# EAGLE design Sensor-platiene (EAGLE 9.6.1)
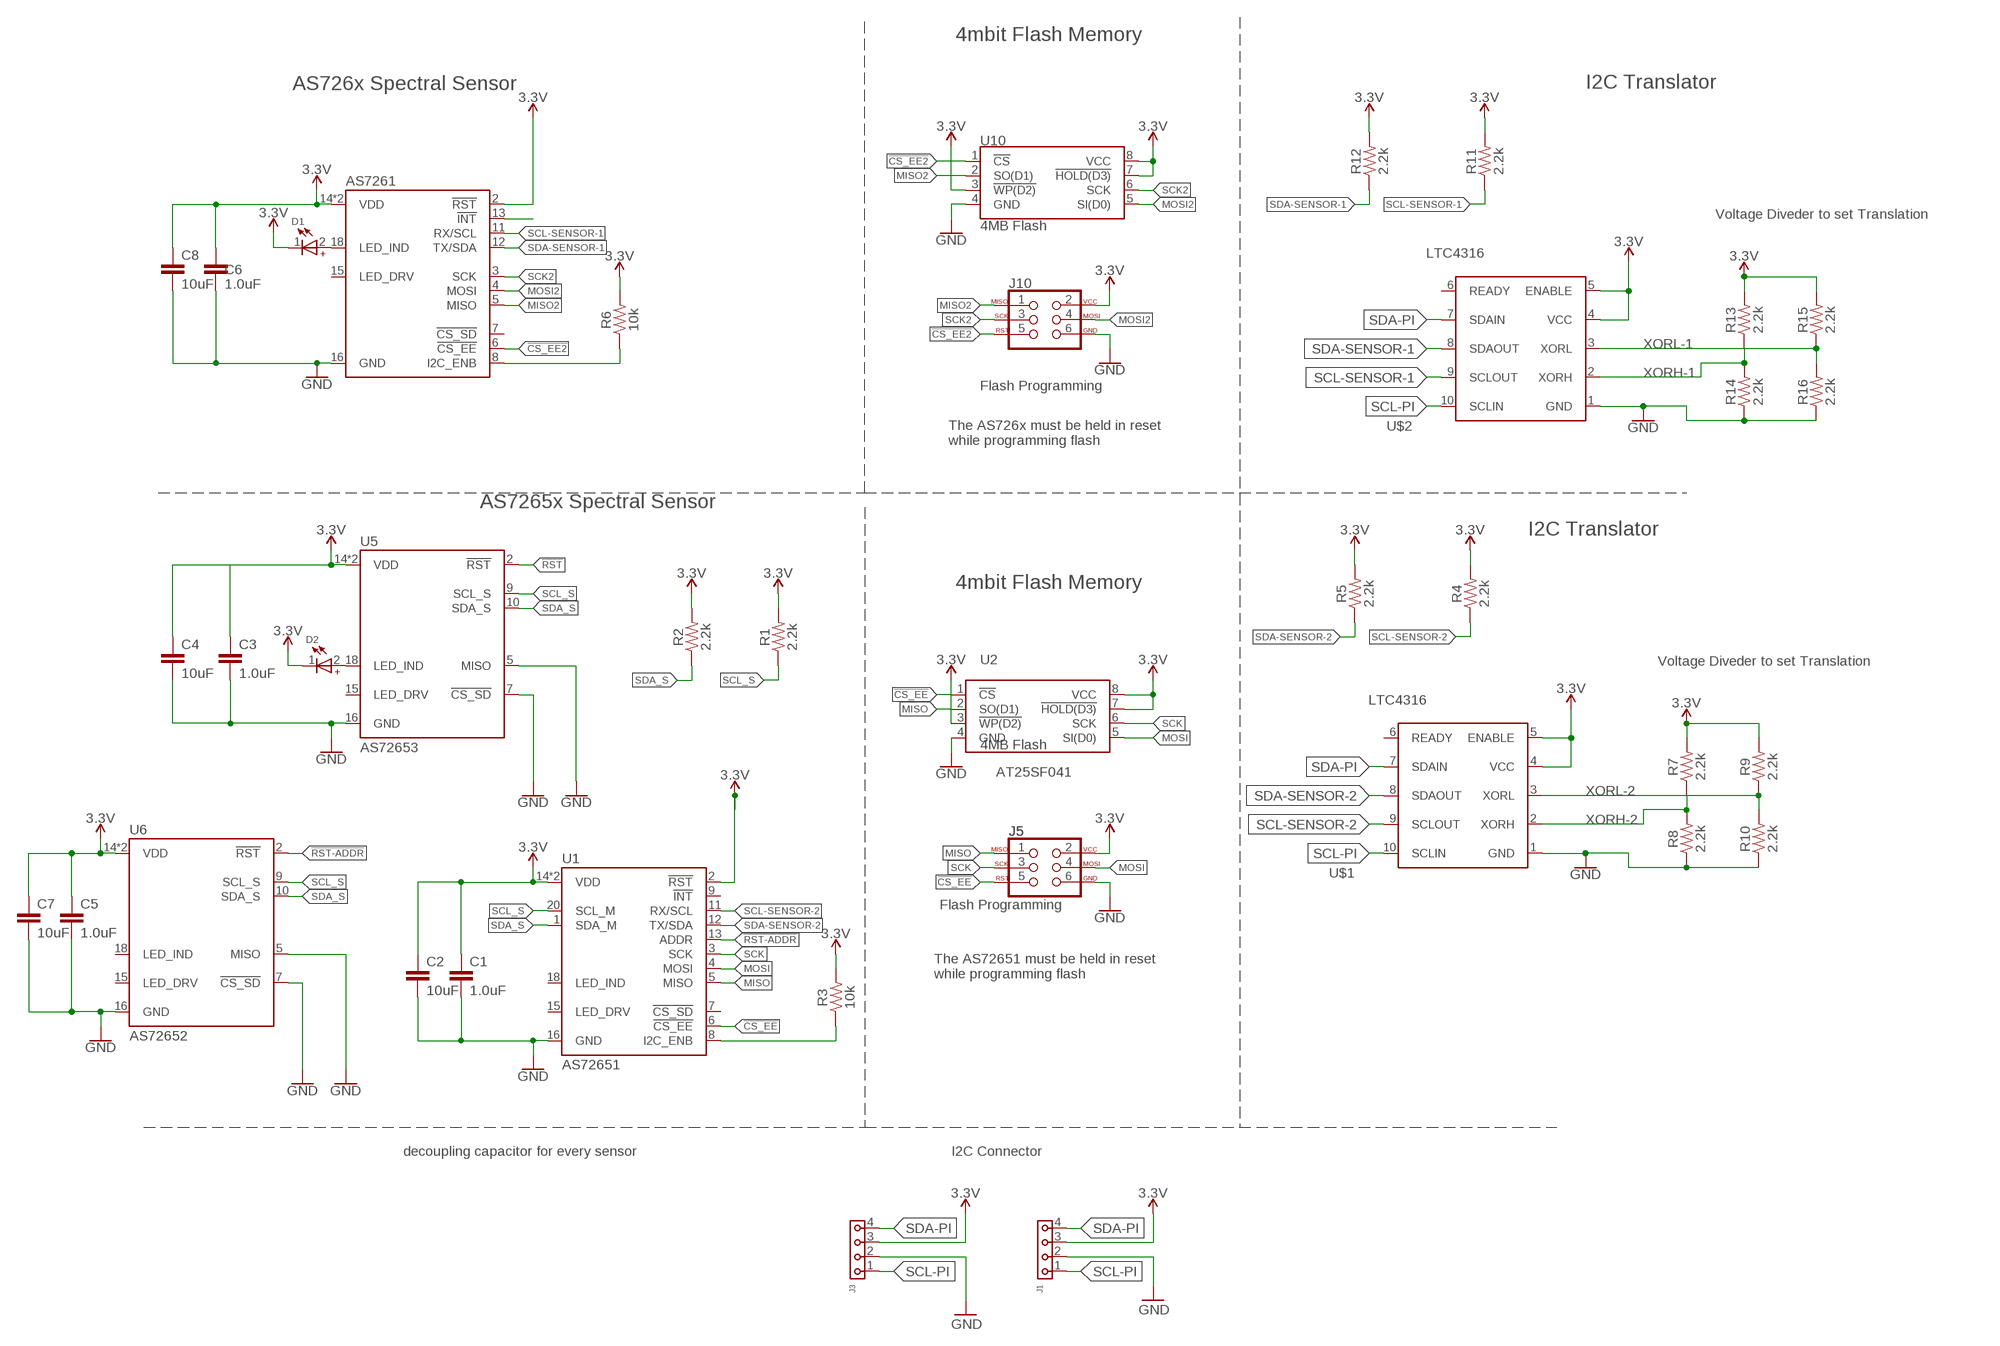
[diagram p0: schematic, sheet 1]

## Parts
AS7261  IR  AS726XIR  [LGA20]
C1  1.0uF  1.0UF-0603-16V-10%  [0603]
C2  10uF  10UF-0603-6.3V-20%  [0603]
C3  1.0uF  1.0UF-0603-16V-10%  [0603]
C4  10uF  10UF-0603-6.3V-20%  [0603]
C5  1.0uF  1.0UF-0603-16V-10%  [0603]
C6  1.0uF  1.0UF-0603-16V-10%  [0603]
C7  10uF  10UF-0603-6.3V-20%  [0603]
C8  10uF  10UF-0603-6.3V-20%  [0603]
D1  WL-SMCW_1206_150120RS75000  [WL-SMCW_1206]
D2  WL-SMCW_1206_150120RS75000  [WL-SMCW_1206]
J1  6130XX11821_61300411821  [61300411821]
J3  6130XX11821_61300411821  [61300411821]
J5  Flash Programming  AVR_SPI_PROG_3X2TESTPOINTS  [2X3_TEST_POINTS]
J10  Flash Programming  AVR_SPI_PROG_3X2TESTPOINTS  [2X3_TEST_POINTS]
R1  2.2k  2.2KOHM-0603-1/10W-1%  [0603]
R2  2.2k  2.2KOHM-0603-1/10W-1%  [0603]
R3  10k  10KOHM-0603-1/10W-1%  [0603]
R4  2.2k  2.2KOHM-0603-1/10W-1%  [0603]
R5  2.2k  2.2KOHM-0603-1/10W-1%  [0603]
R6  10k  10KOHM-0603-1/10W-1%  [0603]
R7  2.2k  2.2KOHM-0603-1/10W-1%  [0603]
R8  2.2k  2.2KOHM-0603-1/10W-1%  [0603]
R9  2.2k  2.2KOHM-0603-1/10W-1%  [0603]
R10  2.2k  2.2KOHM-0603-1/10W-1%  [0603]
R11  2.2k  2.2KOHM-0603-1/10W-1%  [0603]
R12  2.2k  2.2KOHM-0603-1/10W-1%  [0603]
R13  2.2k  2.2KOHM-0603-1/10W-1%  [0603]
R14  2.2k  2.2KOHM-0603-1/10W-1%  [0603]
R15  2.2k  2.2KOHM-0603-1/10W-1%  [0603]
R16  2.2k  2.2KOHM-0603-1/10W-1%  [0603]
U1  AS72651  [LGA20]
U2  4MB Flash  AT25SF041  [SO08]
U5  AS72653  [LGA20]
U6  AS72652  [LGA20]
U10  4MB Flash  AT25SF041  [SO08]
U$1  LTC4316  [MS-PACKAGE]
U$2  LTC4316  [MS-PACKAGE]

## Nets
3.3V [Power]: AS7261.2(!RST) AS7261.14(VDD) AS7261.17(VDD) C1.1 C2.1 C3.1 C4.1 C5.1 C6.1 C7.1 C8.1 D1.1(-) D2.1(-) J1.3 J3.3 J5.2 J10.2 R1.2 R2.2 R3.2 R4.2 R5.2 R6.2 R7.2 R9.2 R11.2 R12.2 R13.2 R15.2 U1.2(!RST) U1.14(VDD) U1.17(VDD) U2.3(!WP(D2)) U2.7(!HOLD(D3)) U2.8(VCC) U5.14(VDD) U5.17(VDD) U6.14(VDD) U6.17(VDD) U10.3(!WP(D2)) U10.7(!HOLD(D3)) U10.8(VCC) U$1.4(VCC) U$1.5(ENABLE) U$2.4(VCC) U$2.5(ENABLE)
!CS_EE: J5.5 U1.6(!CS_EE) U2.1(!CS)
!CS_EE2: AS7261.6(!CS_EE) J10.5 U10.1(!CS)
!RST: U5.2(!RST)
!RST-ADDR: U1.13(ADDR) U6.2(!RST)
GND: AS7261.16(GND) C1.2 C2.2 C3.2 C4.2 C5.2 C6.2 C7.2 C8.2 J1.2 J3.2 J5.6 J10.6 R8.1 R10.1 R14.1 R16.1 U1.16(GND) U2.4(GND) U5.5(MISO) U5.7(!CS_SD) U5.16(GND) U6.5(MISO) U6.7(!CS_SD) U6.16(GND) U10.4(GND) U$1.1(GND) U$2.1(GND)
I2C_ENB: R3.1 U1.8(I2C_ENB)
MISO: J5.1 U1.5(MISO) U2.2(SO(D1))
MISO2: AS7261.5(MISO) J10.1 U10.2(SO(D1))
MOSI: J5.4 U1.4(MOSI) U2.5(SI(D0))
MOSI2: AS7261.4(MOSI) J10.4 U10.5(SI(D0))
N$1: AS7261.18(LED_IND) D1.2(+)
N$3: AS7261.8(I2C_ENB) R6.1
N$4: D2.2(+) U5.18(LED_IND)
N$6: AS7261.13(!INT)
SCK: J5.3 U1.3(SCK) U2.6(SCK)
SCK2: AS7261.3(SCK) J10.3 U10.6(SCK)
SCL-PI: J1.1 J3.1 U$1.10(SCLIN) U$2.10(SCLIN)
SCL-SENSOR-1: AS7261.11(RX/SCL) R11.1 U$2.9(SCLOUT)
SCL-SENSOR-2: R4.1 U1.11(RX/SCL) U$1.9(SCLOUT)
SCL_S: R1.1 U1.20(SCL_M) U5.9(SCL_S) U6.9(SCL_S)
SDA-PI: J1.4 J3.4 U$1.7(SDAIN) U$2.7(SDAIN)
SDA-SENSOR-1: AS7261.12(TX/SDA) R12.1 U$2.8(SDAOUT)
SDA-SENSOR-2: R5.1 U1.12(TX/SDA) U$1.8(SDAOUT)
SDA_S: R2.1 U1.1(SDA_M) U5.10(SDA_S) U6.10(SDA_S)
XORH-1 [Power]: R13.1 R14.2 U$2.2(XORH)
XORH-2 [Power]: R7.1 R8.2 U$1.2(XORH)
XORL-1 [Power]: R15.1 R16.2 U$2.3(XORL)
XORL-2 [Power]: R9.1 R10.2 U$1.3(XORL)
Unconnected: AS7261.7(!CS_SD) AS7261.15(LED_DRV) U1.7(!CS_SD) U1.9(!INT) U1.15(LED_DRV) U1.18(LED_IND) U5.15(LED_DRV) U6.15(LED_DRV) U6.18(LED_IND) U$1.6(READY) U$2.6(READY)

## Notes on the sheet
- 4mbit Flash Memory
- AS726x Spectral Sensor | I2C Translator
- Voltage Diveder to set Translation
- The AS726x must be held in reset 
  while programming flash
- AS7265x Spectral Sensor
- I2C Translator
- 4mbit Flash Memory
- Voltage Diveder to set Translation
- AT25SF041
- The AS72651 must be held in reset
  while programming flash
- decoupling capacitor for every sensor | I2C Connector

## Library data of the parts
AS7261 = SparkFun-Sensors:AS726X; PROD_ID: IC-13731
C1 C3 C5 C6 = SparkFun-Capacitors:1.0UF: 1µF ceramic capacitors A capacitor is a passive two-terminal electrical component used to store electrical energy temporarily in an electric field.; PROD_ID: CAP-00868
C2 C4 C7 C8 = SparkFun-Capacitors:10UF: 10.0µF ceramic capacitors A capacitor is a passive two-terminal electrical component used to store electrical energy temporarily in an electric field.; PROD_ID: CAP-11015
D1 D2 = 150120RS75000_Eagle_WL-SMCW_rev20b:WL-SMCW_1206: WL-SMCW SMT Mono-color Chip LED Waterclea Characteristics Low energy consumption High reliability Low current requirement Fast switching No UV/IR radiation Smallest SMD LED package for exceptional brightness Top view LED Wide viewing angle Better solder ability Heat dissipation Applications Backlight for mobile and portable device keypads Indoor and outdoor message boards Flat backlight for LCDs, switches and symbols Display for industrial control systems and traffic Miniaturized color effects Pedestrian mark Optical indicators Tabular backlight: LCD, telephone key-press, power-switch, display board Indoor displays Signals Identifiers Backlight for automobile DVD LED General lighting Toys <https://www.we-online.com/catalog/media/o14904v209%20Family_WL-SMCW.jpg> Details see: https://www.we-online.com/catalog/en/WL-SMCW/ Updated BY Yingchun,Shan 2020-03-18 2020(C) Wurth Elektronik; ABSTRAHLWINKEL: 140°; CHIP-TECHNOLOGY: AlInGaP; DATASHEET-URL: https://www.we-online.com/catalog/datasheet/150120RS75000.pdf; EMITTING-COLOR: Red; I-V-TYP: 150mcd; LAMDA-DOM-TYP: 625nm; LAMDA-PEAK-TYP: 630nm; PART-NUMBER: 150120RS75000; V-F-TYP: 2V
J1 J3 = 61300411121_Eagle_WR-PHD_rev19a:6130XX11821_61300411821: WR-PHD 2.54 mm Socket Header ARTICLE PROPERTIES: Pins:1;​ 2;​ 3;​ 4;​ 5;​ 6;​ 7;​ 8;​ 9;​ 10;​ 12;​ 13;​ 14;​ 15;​ 16;​ 18;​ 20;​ 22;​ 24;​ 25;​ 32;​ 36;​ 40 KIND PROPERTIES: Pitch：2.54 mm Quality Class:3 as per CECC 75 301-802 Rows：Single Gender：Socket Header;​ Female Type：Straight MATERIAL PROPERTIES: Insulator Material :PBT Insulator Flammability Rating:UL94 V-0 Contact Material:Copper Alloy Contact Plating:Gold Contact Type:Stamped GENERAL INFORMATION Operating Temperature:-40 up to +125 °C Compliance:Lead free / RoHS ELECTRICAL PROPERTIES: Rated Current:3 A IR 1:3 A Withstanding Voltage:500 V (AC) Contact Resistance:20 mΩ RISO:1000 MΩ CERTIFICATION UL Approval:E323964 PACKAGING PROPERTIES Packaging:Tray <https://katalog.we-online.com/media/images/v2/o33218v209%20Family_WR-PHD_613xxx11821.jpg> Details see: https://katalog.we-online.com/en/em/PHD_2_54_SOCKET_HEADER_6130XX11821 Updated by Yingchun,Shan 2019-10-21 2019 (C) Würth Elektronik; DATASHEET-URL: https://katalog.we-online.com/em/datasheet/61300411821.pdf; GENDER: Socket Header; IR: 3A; MATES: WR-PHD 2.54mm SMT Pin Header/THT Angled Pin Header/THT Pin Header; PACKAGING: Tray; PART-NUMBER: 61300411821; PINS: 4; ROWS: Single; TYPE: Straight
J5 J10 = SparkFun-Connectors:AVR_SPI_PROG_3X2: AVR ISP 6 Pin This is the reduced ISP connector for AVR programming. Common on Arduino. This footprint will take up less PCB space and can be used with a 10-pin to 6-pin adapter such as SKU: BOB-08508 **Special note about "TEST_POINT" package. The stop mask is on the top side, so if you want your programming test points to be on the bottom of your board, make sure to place this package on the bottom side of the board. This also ensure that the orientation to program from the bottom side will be correct. SparkFun Products: SparkFun ISP Pogo Adapter <https://www.sparkfun.com/products/11591> - NS Tiny AVR Programmer <https://www.sparkfun.com/products/11801> -PTH
R1 R2 R4 R5 R7-R16 = SparkFun-Resistors:2.2KOHM: 2.2kΩ resistor A resistor is a passive two-terminal electrical component that implements electrical resistance as a circuit element. Resistors act to reduce current flow, and, at the same time, act to lower voltage levels within circuits. - Wikipedia; PROD_ID: RES-08272
R3 R6 = SparkFun-Resistors:10KOHM: 10kΩ resistor A resistor is a passive two-terminal electrical component that implements electrical resistance as a circuit element. Resistors act to reduce current flow, and, at the same time, act to lower voltage levels within circuits. - Wikipedia; PROD_ID: RES-00824
U1 = Qwiic_Spectral_Sensor-AS7265x:AS72651; PROD_ID: IC-14127
U2 U10 = SparkFun-IC-Memory:AT25SF041: AT25SF041 4Mb Serial Flash Memory 104MHz, SPI, 8-SOIC Datasheet <http://www.adestotech.com/wp-content/uploads/DS-AT25SF041_044.pdf> SparkFun Products: SparkFun ESP8266 Thing <https://www.sparkfun.com/products/13231> SparkFun ESP8266 Thing - Dev Board <https://www.sparkfun.com/products/13711>; PROD_ID: IC-12455
U5 = Qwiic_Spectral_Sensor-AS7265x:AS72653; PROD_ID: IC-14129
U6 = Qwiic_Spectral_Sensor-AS7265x:AS72652; PROD_ID: IC-14128
U$1 U$2 = I2c-adress-translotor:LTC4316

## Net classes
1 Power: width 0.305 mm

## Board
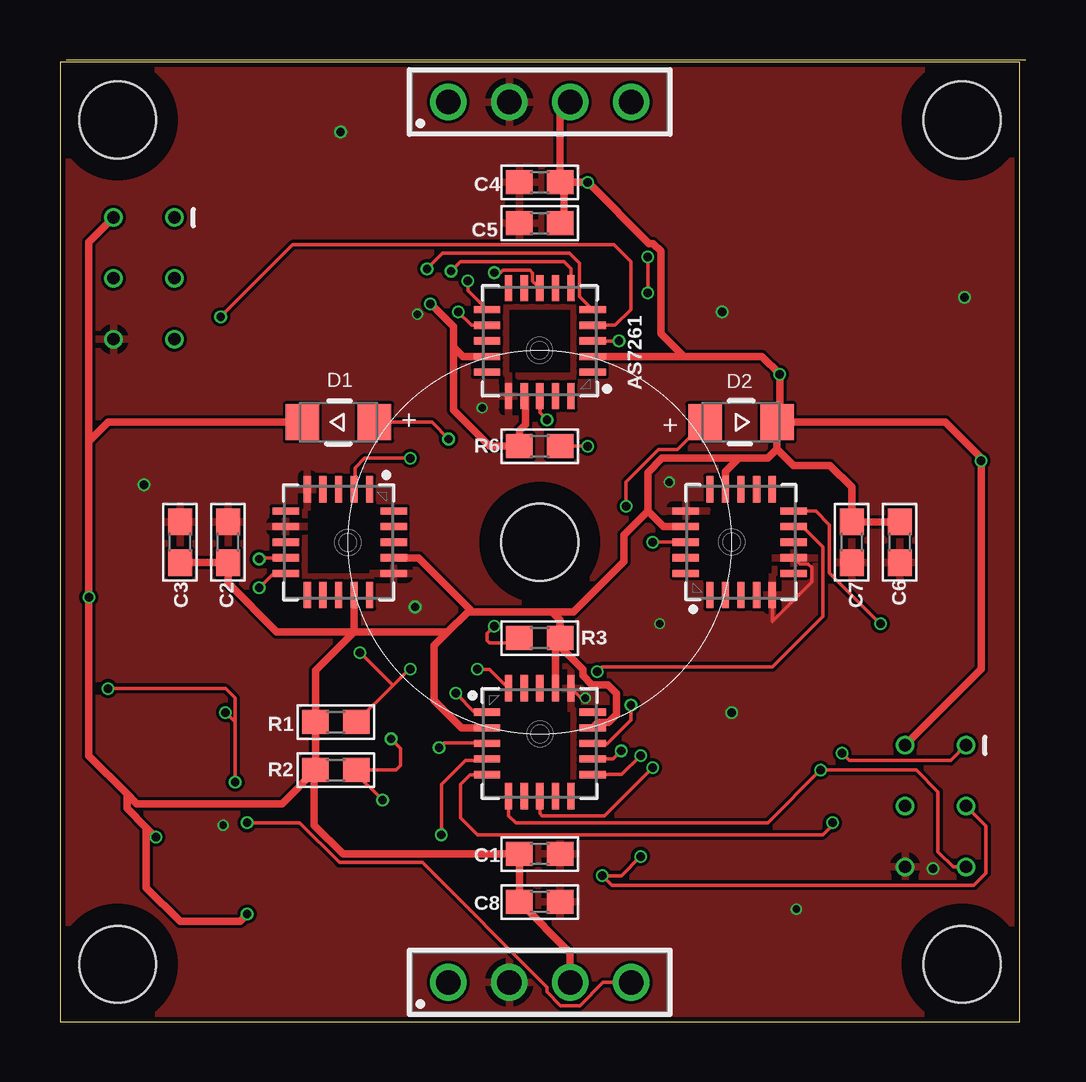
[diagram p1: board, top side]
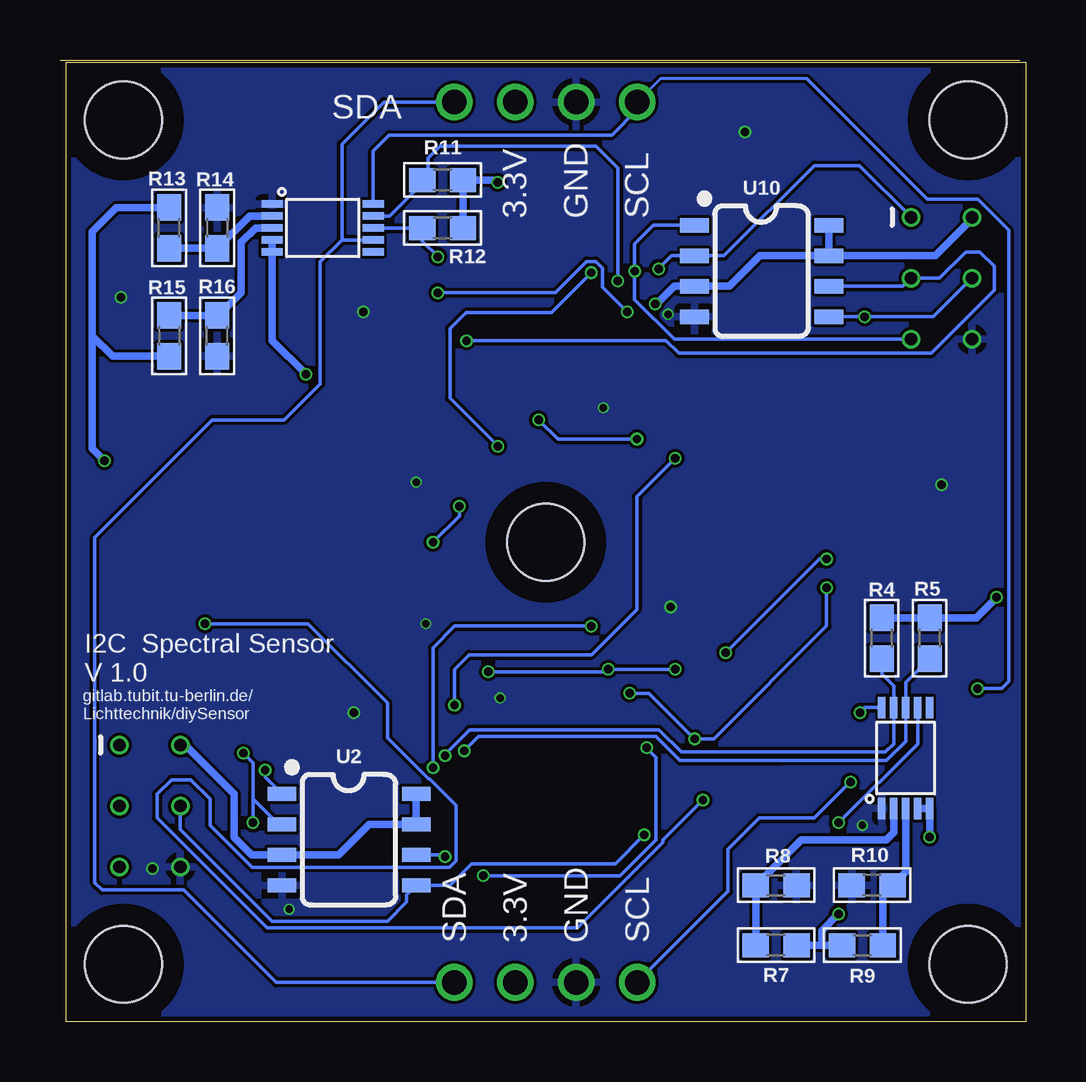
[diagram p2: board, bottom side, seen from below]

Size 40.25 x 40.1 mm. Coordinates in mm from the lower left corner, seen from the top.
Outline: 40.25,40.1 0.25,40.1
Outline: 0,0 40,0 40,40 0,40 0,0
Copper layers (1*16): Top 0.035559375mm / dielectric 1.6mm / Bottom 0.035559375mm
Design rules "jlcpcb2layer": minimum track width 5mil, minimum drill 12mil, track to track 5mil, track to pad 5mil, pad to pad 5mil, via to via 5mil, smd to smd 5mil, copper to edge 8mil, drill to drill 6mil, minimum pad ring 5mil, minimum via ring 3mil, stop-mask expansion 2.5mil, vias tented up to drill 0mil, thermal gap 10mil

### Footprints (pad centres in the part's own frame; a part is rotated, then mirrored left to right if it is on the bottom)
LGA20 = smd 1.1 x 0.3: 1 -2.2,1.3; 2 -2.2,0.65; 3 -2.2,0; 4 -2.2,-0.65; 5 -2.2,-1.3; 11 2.2,-1.3; 12 2.2,-0.65; 13 2.2,0; 14 2.2,0.65; 15 2.2,1.3 | smd 0.3 x 1.1: 6 -1.3,-2.2; 7 -0.65,-2.2; 8 0,-2.2; 9 0.65,-2.2; 10 1.3,-2.2; 16 1.3,2.3; 17 0.65,2.3; 18 0,2.3; 19 -0.65,2.3; 20 -1.3,2.3
0603 = smd 1.1 x 1: 1 -0.85,0; 2 0.85,0
WL-SMCW_1206 = smd 1.4 x 1.5: 1 -1.5,0; 2 1.5,0
61300411821 = drill 1.02: 1 -3.81,0; 2 -1.27,0; 3 1.27,0; 4 3.81,0
2X3_TEST_POINTS = drill 0.508: 1 -2.54,-1.27; 2 -2.54,1.27; 3 0,-1.27; 4 0,1.27; 5 2.54,-1.27; 6 2.54,1.27
SO08 = smd 0.6 x 1.2: 1 -1.905,-2.8; 2 -0.635,-2.8; 3 0.635,-2.8; 4 1.905,-2.8; 5 1.905,2.8; 6 0.635,2.8; 7 -0.635,2.8; 8 -1.905,2.8
MS-PACKAGE = smd 0.305 x 0.889: 1 -1,-2.106; 2 -0.5,-2.106; 3 0,-2.106; 4 0.5,-2.106; 5 1,-2.106; 6 1,2.106; 7 0.5,2.106; 8 0,2.106; 9 -0.5,2.106; 10 -1,2.106
3-2MM-HOLE = hole 3.2: 0,0

### Placement (x,y rotation side)
AS7261  20,28.39 180 top
C1  20,7 0 top
C2  7,20 90 top
C3  5,20 90 top
C4  20,35 180 top
C5  20,33.3 180 top
C6  35,20 270 top
C7  33,20 270 top
C8  20,5 0 top
D1  11.61,25 0 top
D2  28.39,25 180 top
J1  20,1.65 0 top
J3  20,38.35 0 top
J5  36.5,9 270 bottom
J10  3.5,31 270 bottom
R1  11.5,12.5 180 top
R2  11.5,10.5 180 top
R3  20,16 0 top
R4  6,16 90 bottom
R5  4,16 90 bottom
R6  20,24 180 top
R7  10.4,3.2 0 bottom
R8  10.4,5.7 180 bottom
R9  6.8,3.2 180 bottom
R10  6.4,5.7 0 bottom
R11  24.3,35.1 0 bottom
R12  24.3,33.1 0 bottom
R13  35.7,33.1 90 bottom
R14  33.7,33.1 270 bottom
R15  35.7,28.6 270 bottom
R16  33.7,28.6 90 bottom
U1  20,11.61 0 top
U2  28.2,7.6 270 bottom
U5  28.39,20 90 top
U6  11.61,20 270 top
U10  11,31.3 270 bottom
U$1  5,11 0 bottom
U$2  29.3,33.1 270 bottom
U$3  [3-2MM-HOLE]  2.4,2.4 0 top
U$4  [3-2MM-HOLE]  20,20 0 top
U$5  [3-2MM-HOLE]  2.4,37.6 0 top
U$6  [3-2MM-HOLE]  37.6,37.6 0 top
U$7  [3-2MM-HOLE]  37.6,2.4 0 top

### Tracks (layer width: path | path; a pad name or v marks a point on that pad's centre or on a via)
3.3V  (via drill 0.35)
  Top 0.305: 21,35 C4.1 20.85,37.93 J3.3 | 21,35 v22,35 24.56,32.44 24.72,32.44 25.04,32.12 25.04,28.7 26,27.74 | C5.1 21,33.45 21,35 | C6.1 C7.1 33,22.3 32.1,23.2 30.58,23.2 29.89,23.89 | R2.2 R1.2 10.65,14.65 12.26,16.26 | C3.1 C2.1 7,18.3 9.04,16.26 12.26,16.26 | 1.2,24.2 v1.2,17.7 1.2,11.1 2.8,9.5 | D1.1 2,25 1.2,24.2 | R2.2 9.25,9.1 3.2,9.1 2.8,9.5 | R2.2 10.6,10.45 10.6,8.2 11.8,7 C1.1 C8.1 21.27,2.88 J1.3 | 30,25 D2.1 29.89,23.89 | 30,25 36.9,25 38.4,23.5 v38.4,23.4 38.4,14.71 J5.2 | AS7261.17 19.4,26.04 19.4,24.9 19.15,24.65 R6.2 17.9,24 16.4,25.5 16.4,28.14 | AS7261.14 16.8,27.74 16.4,28.14 | v15.44,29.94 16.4,28.98 16.4,28.14 | 20.65,15.6 20.65,15.8 R3.2 20.85,16.75 20.5,17.1 | 20.65,15.6 U1.17 | U5.14 27.74,22.94 28.3,23.5 | 28.3,23.5 29.5,23.5 29.89,23.89 | U5.17 25.15,20.65 24.5,21.3 | 24.5,21.3 24.5,22.9 25.1,23.5 28.3,23.5 | 1.2,24.2 1.2,32.51 J10.2 | U1.2 16.74,12.26 15.6,13.4 15.6,15.7 16.16,16.26 | 17,17.1 17.1,17.2 14.95,19.35 U6.17 | 17,17.1 16.16,16.26 | 17,17.1 20.5,17.1 | U6.14 12.26,16.26 | 30,25 v30,27 29.26,27.74 26,27.74 | AS7261.2 26,27.74 | 2.8,9.5 2.8,8.9 3.6,8.1 | 3.6,8.1 v4,7.7 | U1.14 22.42,12.48 22.87,12.48 23.2,12.82 23.2,13.7 22.84,14.06 22.18,14.06 21.8,14.43 21.8,14.7 20.9,15.6 20.65,15.6 | 12.26,16.26 16.16,16.26 | 20.5,17.1 21.4,17.1 23.5,19.2 23.5,20.3 24.5,21.3 | 3.6,8.1 3.6,5.6 5,4.2 7.5,4.2 v7.8,4.5
  Bottom 0.305: v22,35 22.1,35.1 R11.2 R12.2 | R9.2 8.5,3.2 | 8.5,3.2 R7.2 | v4,7.7 U$1.5 U$1.4 | U2.8 U2.7 27.36,8.23 28.64,6.96 U2.3 32.27,6.96 33,7.7 33,9.5 35.04,11.54 J5.2 | v38.4,23.4 38.9,23.9 38.9,28.6 | v15.44,29.94 15.36,29.94 14.63,30.66 U10.3 12.34,30.66 11.06,31.93 U10.7 | U10.7 U10.8 | U$2.4 U$2.5 31.41,28.41 v30,27 | J10.2 2.23,33.47 3.77,31.93 U10.7 | R13.2 37.9,33.95 38.9,32.95 38.9,28.6 | R4.2 R5.2 2.05,16.85 v1.2,17.7 | 38.9,28.6 38.05,27.75 R15.2 | v7.8,4.5 8.5,3.8 8.5,3.2
!CS_EE  (via drill 0.35)
  Top 0.152: J5.5 37.24,6.46 36.6,7.1 36.6,9.6 35.7,10.5 v31.7,10.5 29.5,8.3 19,8.3 18.7,8.6 U1.6
  Bottom 0.152: U2.1 31.7,10.21 v31.7,10.5
!CS_EE2  (via drill 0.35)
  Top 0.152: AS7261.6 21.3,31.4 21,31.7 16.7,31.7 v16.3,31.3
  Bottom 0.152: J10.5 14.64,28.46 16.3,30.11 v16.3,31.3 16.3,32.42 15.52,33.2 U10.1
!RST-ADDR  (via drill 0.35)
  Top 0.152: U6.2 12.3,22.24 12.3,23.1 12.7,23.5 v14.6,23.5 | v23.8,13.2 23.8,12.6 22.8,11.6 22.21,11.6 U1.13
  Bottom 0.152: v14.6,23.5 16.2,21.9 16.2,17.2 18.1,15.3 23.2,15.3 23.8,14.7 v23.8,13.2
GND  (via drill 0.3, 0.35)
  Top 0.152: U5.7 30.84,19.1 31.18,19.1 31.34,18.93 31.34,18.34 29.7,16.7 29.7,17.79 U5.5 | v21.9,13.5 21.71,13.5 U1.16
  other vias: 14.8,17.3 28,12.9 27.6,29.6 37.7,30.2 3.5,22.4 11.7,37.1 36.4,6.4 30.7,4.7 25,16.6 25.4,22.5 6.8,8.2 17.6,25.6 14.9,29.5
  pour Bottom (isolate 0.016): 40.2,0 40.2,39.7 40.1,39.8 0,39.8 -0.1,39.7 -0.1,-0.1 40.1,-0.1
  pour Top (isolate 0.016): 0.1,39.9 0.1,0 39.8,0 39.9,0.1 39.9,40 39.8,39.9
  pour Top (isolate 0.016): 0.1,39.9 0.1,0 39.8,0 39.9,0.1 39.9,40 39.8,39.9
I2C_ENB  (via drill 0.35)
  Top 0.152: v18.1,16.5 17.8,16.2 17.8,15.9 17.9,15.8 18.95,15.8 R3.1 | U1.8 20,8.7 20.1,8.6 22.7,8.6 v24.7,10.6
  Bottom 0.152: v24.7,10.6 24.7,15.6 23.8,16.5 v18.1,16.5
MISO  (via drill 0.35)
  Top 0.152: J5.1 37.13,10.9 32.9,10.9 v32.6,11.2 | U1.5 17.79,10.3 17.1,10.3 16.7,9.9 16.7,8.5 17.4,7.8 31.8,7.8 32.2,8.2 v32.2,8.3
  Bottom 0.152: v32.6,11.2 32.2,10.8 32.2,9.6 32.2,9.3 | 32.2,9.3 31.14,8.23 U2.2 | v32.2,8.3 32.2,9.3
MISO2  (via drill 0.35)
  Top 0.152: v15.3,31.4 15.94,32.04 21.23,32.04 21.65,31.62 21.65,30.23 AS7261.5
  Bottom 0.152: J10.1 6.93,35.7 8.8,35.7 12.56,31.93 U10.2 14.77,31.93 v15.3,31.4
MOSI  (via drill 0.35)
  Top 0.152: U1.4 17.74,10.9 16.9,10.9 15.9,9.9 v15.9,7.8
  Bottom 0.152: J5.4 35.23,8.03 31.4,4.2 26.6,4.2 25.8,5 25.8,5.29 U2.5 25.3,5.8 25.2,5.7 24,5.7 23.1,6.6 21.4,6.6 21,6.6 17.1,6.6 v15.9,7.8
MOSI2  (via drill 0.35)
  Top 0.152: AS7261.4 23.14,29.04 23.8,29.7 23.8,31.7 23.1,32.4 9.71,32.4 v6.7,29.39
  Bottom 0.152: U10.5 v6.7,29.39 3.83,29.39 J10.4
N$1  (via drill 0.35)
  Top 0.152: AS7261.18 20,25.4 v20.3,25.1 | D1.2 15.5,25 v16.2,24.3
  Bottom 0.152: v20.3,25.1 19.5,24.3 v16.2,24.3
N$3  (via drill 0.35)
  Top 0.152: R6.1 21.9,24 | AS7261.8 19.7,30.89 19.7,31.22 19.58,31.34 18.47,31.34 18.36,31.23 v18.1,31.23
  Top 0.305: 21.9,24 v22,24
  Bottom 0.152: v18.1,31.23 19.77,29.57 23.33,29.57 24,28.9 24,26 v22,24
N$4  (via drill 0.35)
  Top 0.152: D2.2 25.74,23.86 24.95,23.86 23.6,22.5 v23.6,21.5 | v24.7,20 U5.18
  Bottom 0.152: v23.6,21.5 23.6,21.1 v24.7,20
SCK  (via drill 0.35)
  Top 0.152: U1.3 17.78,11.63 16,11.63 v15.8,11.43 | J5.3 38.6,8.17 38.6,6.2 38.1,5.7 23,5.7 v22.6,6.1 23.4,6.1 v24.2,6.9
  Bottom 0.152: v15.8,11.43 15.4,11.03 15.4,7.6 16.9,6.1 v22.6,6.1 | U2.6 24.27,6.96 v24.2,6.9
SCK2  (via drill 0.35)
  Top 0.152: AS7261.3 23.29,28.39 v23.3,28.4
  Bottom 0.152: U10.6 5.11,30.66 J10.3 3.6,31 2.5,32.1 1.9,32.1 1.3,31.5 1.3,30.5 3.92,27.88 14.46,27.88 14.98,28.4 v23.3,28.4
SCL-PI  (via drill 0.35)
  Top 0.152: v7.3,10 7.3,12.5 | v6.9,12.9 7.3,12.5 | 7.3,12.5 7.3,13.5 6.9,13.9 v2,13.9
  Bottom 0.127: 9.12,39.32 15.22,39.32 J3.1
  Bottom 0.152: U$2.10 27.2,36.31 26.53,36.97 17.24,36.97 16.19,38.02 J3.1 | J1.1 12.4,5.44 12.4,7.2 11.1,8.5 8.8,8.5 v7.3,10 | v6.9,12.9 6.69,13.11 U$1.10 | 9.12,39.32 4.1,34.3 2,34.3 0.7,33 0.7,14.2 1,13.9 v2,13.9
SCL-SENSOR-1  (via drill 0.35)
  Top 0.152: AS7261.11 17,30.49 v17,30.9
  Bottom 0.152: U$2.9 26.5,33.6 25.15,34.95 | R11.1 24.9,35.35 24.9,36 24.4,36.5 17.9,36.5 17,35.6 v17,30.9
  Bottom 0.305: R11.1 25.15,34.95
SCL-SENSOR-2  (via drill 0.35)
  Top 0.152: U1.11 23.41,10.31 v24.2,11.1
  Bottom 0.152: R4.1 6,14.5 5.5,14 U$1.9 5.5,11.6 5.85,11.25 14.35,11.25 15.28,12.18 23.18,12.18 24.16,11.2 24.2,11.2 v24.2,11.1
SCL_S  (via drill 0.35)
  Top 0.152: R1.1 13.88,14.03 | 13.88,14.03 14.55,14.7 v14.6,14.7 | v17.4,14.7 17.91,14.7 U1.20 | 13.88,14.03 v12.5,15.4 | v8.3,19.3 8.35,19.35 U6.9 | U5.9 30.95,20.65 31.8,19.8 31.8,16.9 29.7,14.8 22.6,14.8 v22.4,14.6
  Bottom 0.152: v14.6,14.7 v17.4,14.7 17.5,14.6 v22.4,14.6 | v12.5,15.4 8.6,19.3 v8.3,19.3
SDA-PI  (via drill 0.35)
  Top 0.152: v7.8,8.3 10,8.3 11.65,6.64 15.11,6.64 20.3,1.45 20.3,1.25 20.87,0.68 21.67,0.68 22.64,1.65 J1.4
  Bottom 0.152: U$2.7 28.5,32.6 | J1.4 31.25,1.65 35.1,5.5 38.5,5.5 38.8,5.8 38.8,20.2 33.9,25.1 30.9,25.1 29.4,26.6 29.4,31.7 28.5,32.6 | U$1.7 4.5,11.6 v7.8,8.3 | 28.5,32.6 28.5,36.59 26.74,38.35 J3.4
SDA-SENSOR-1  (via drill 0.35)
  Top 0.152: v24.5,31.9 v24.5,30.4 | v16.6,29.6 17.16,29.04 AS7261.12
  Bottom 0.152: U$2.8 R12.1 25.15,32.55 v24.5,31.9 | v24.5,30.4 19.59,30.4 18.29,31.7 17.91,31.7 17.63,31.43 17.63,30.63 v16.6,29.6
SDA-SENSOR-2  (via drill 0.35)
  Top 0.152: U1.12 23.06,10.96 v23.4,11.3
  Bottom 0.152: v23.4,11.3 22.8,11.9 15.4,11.9 14.4,10.9 10.3,10.9 10.2,10.9 5.8,10.9 5,11.7 U$1.8 5,14.15 R5.1
SDA_S  (via drill 0.35)
  Top 0.152: v13.8,11.8 14.2,11.4 14.2,10.7 14,10.5 R2.1 12.35,10.35 v13.45,9.25 | U1.1 17.29,12.91 v16.5,13.7 | U6.10 8.9,18.7 v8.3,18.1 | U5.10 31.5,21.3 32.08,20.72 32.08,18.72 v34.2,16.6
  Bottom 0.152: v16.5,13.7 15.7,13.7 v13.8,11.8 13,11.8 8.3,16.5 v8.3,18.1 | v13.45,9.25 15.12,7.58 15.12,7.48 18.68,3.92 31.62,3.92 36.2,8.5 36.2,9.5 35.6,10.1 34.8,10.1 34,9.3 34,8.2 32.24,6.43 24.01,6.43 23.73,6.71 23.73,9.03 24.84,10.13 24.89,10.13 26.6,11.84 26.6,13.3 29.9,16.6 v34.2,16.6
XORH-1
  Bottom 0.305: R13.1 R14.2 32.35,33.6 U$2.2
XORH-2
  Bottom 0.305: R7.1 R8.2 9.35,7.6 5.8,7.6 5.5,7.9 U$1.2
XORL-1
  Bottom 0.305: U$2.3 32.1,33.1 32.7,32.5 32.7,30.4 33.65,29.45 R16.2 R15.1
XORL-2
  Bottom 0.305: U$1.3 5,6.25 R10.2 5.95,5.3 R9.1

### Text on the board
bPlace: SDA | SCL | GND | 3.3V | I2C Spectral Sensor / V 1.0 | gitlab.tubit.tu-berlin.de/ / Lichttechnik/diySensor | SCL | GND | 3.3V | SDA